# Altium schematic sheet HV_channel.SchDoc: GEM AVD eFuse
size 420 x 297 mm; Author: G.Kasprowicz; CompanyName: WUT ISE; DrawnBy: G.Kasprowicz; Organization: WUT ISE; Address1: PW ISE; Address2: Nowowiejska 15/19 00-665 Warsaw; Address3: gkasprow@gmail.com; Revision: 2; SheetNumber: 2; SheetTotal: 6; ModifiedBy: -; CheckedDate: -; Title2: channel connectors; DivGrp: WUT ISE; Designer: G.Kasprowicz; ModifiedDate: -; ProjectName: Sensor Box
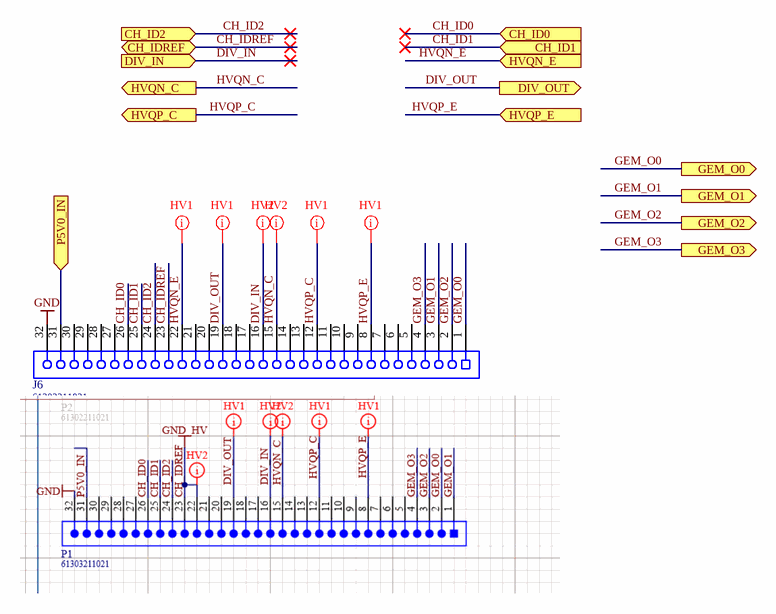
[diagram p0: HV_channel.SchDoc]

## Parts
J6  61303211821  [61303211821]

## Ports
CH_ID0 (in, see GEM_AVD_eFuse[3A]), CH_ID1 (in, see GEM_AVD_eFuse[3A]), CH_ID2 (in, see GEM_AVD_eFuse[3A]), CH_IDREF (bidir, see GEM_AVD_eFuse[3B]), DIV_IN (in, see GEM_AVD_eFuse[3A]), DIV_OUT (out, see GEM_AVD_eFuse[3A]), GEM_O0 (out, see GEM_AVD_eFuse[3B]), GEM_O1 (out, see GEM_AVD_eFuse[3B]), GEM_O2 (out, see GEM_AVD_eFuse[3B]), GEM_O3 (out, see GEM_AVD_eFuse[3B]), HVQN_C (out, see GEM_AVD_eFuse[3B]), HVQN_E (in, see GEM_AVD_eFuse[3A]), HVQP_C (out, see GEM_AVD_eFuse[3A]), HVQP_E (in, see GEM_AVD_eFuse[3B]), P5V0_IN (in, see GEM_AVD_eFuse[3A])

## Nets
GND: J6.32
CH_ID0: J6.26 ; port CH_ID0
CH_ID1: J6.25 ; port CH_ID1
CH_ID2: J6.24 ; port CH_ID2
CH_IDREF: J6.23 ; port CH_IDREF
DIV_IN: J6.16 ; port DIV_IN
DIV_OUT: J6.19 ; port DIV_OUT
GEM_O0: J6.1 ; port GEM_O0
GEM_O1: J6.3 ; port GEM_O1
GEM_O2: J6.2 ; port GEM_O2
GEM_O3: J6.4 ; port GEM_O3
HVQN_C: J6.15 ; port HVQN_C
HVQN_E: J6.22 ; port HVQN_E
HVQP_C: J6.12 ; port HVQP_C
HVQP_E: J6.8 ; port HVQP_E
P5V0_IN: J6.31 ; port P5V0_IN

Not connected (* = marked no-connect by the designer): J6 5 6 7 9 10 11 13 14 17 18 20 21 27 28 29 30

## Layout directives
net class HV2: DIV_IN, HVQN_C
net class HV1: DIV_OUT, HVQN_E, HVQP_C, HVQP_E

## Notes on the sheet
- Project/Equipment
- Document
- Designer
- Drawn by
- Check.by
- Copyright WUT ISE 2020.
  This documentation describes Open Hardware and is licensed under the CERN OHL v.1.2. You may redistribute and modify this documentation under the terms of the CERN OHL v.1.2. (http://ohwr.org/CERNOHL). This documentation is distributed WITHOUT ANY EXPRESS OR IMPLIED WARRANTY, INCLUDING OF MERCHANTABILITY, SATISFACTORY QUALITY AND FITNESS FOR A PARTICULAR PURPOSE. Please see the CERN OHL v.1.2 for applicable conditions.
- Contact
- File
- Last Mod.
- Print Date
- Sheet
- Size
- A3
- of
- Rev

## Library data of the parts
J6 = 61303211821: WR-PHD Socket Header, THT, pitch 2.54mm, Single Row, Vertical, 32p; Manufacturer: Wurth Elektronik; Pin Number: 32; Rated Current: 3A; Working Voltage: 250VAC; Withstanding Voltage: 500VAC; Contact Resistance: 20mOhm; ComponentLink1Description: Manufacturer; ComponentLink1URL: http://www.we-online.de; ComponentLink2Description: Datasheet; ComponentLink2URL: https://www.we-online.com/catalog/datasheet/61303211821.pdf; Manufacturer Part Number: 61303211821; Pitch: 2.54mm; Operating Temperature: -40 to +125degC; Mounting Technology: THT; Packaging: Tray; Gender: Socket Header; Row Number: Single; Orientation: Vertical